# Altium schematic sheet USB.SchDoc
size A4
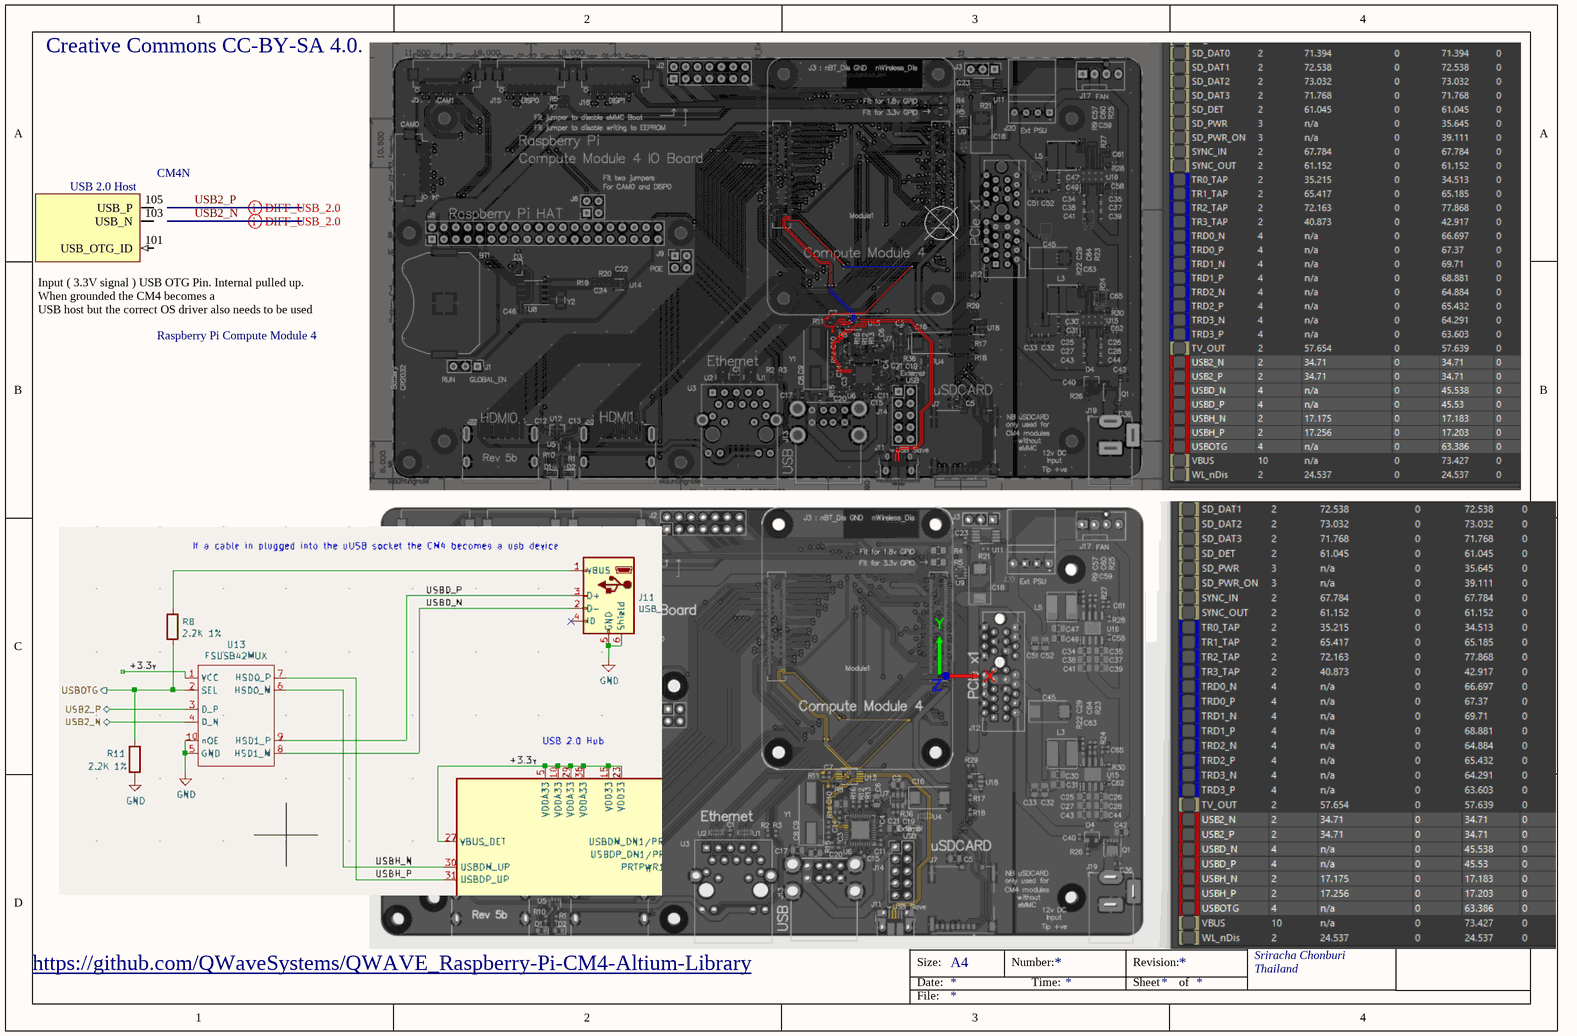
[diagram p0: USB.SchDoc]

## Parts
CM4  Raspberry Pi Compute Module 4  [CM4-F40C-100DS-0.4v_1.5mm_0mm]  (part N of 21)  (no BOM)

## Nets

Not connected (* = marked no-connect by the designer): CM4 101(USB_OTG_ID) 103(USB_N) 105(USB_P)

## Layout directives
differential pair; differential pair class DIFF_90Ohm_USB2.0; differential pair class DIFF_USB2.0; net class USB2.0_480Mbps: USB2_N, USB2_P

## Notes on the sheet
- Creative Commons CC-BY-SA 4.0.
- https://github.com/QWaveSystems/QWAVE_Raspberry-Pi-CM4-Altium-Library
- Title
- Size:
- Date:
- A4
- Number:
- Time:
- Revision:
- Sheet
- of
- Q-Wave Systems Co.,Ltd
- 65/2 Moo 1 Beung
- Sriracha Chonburi
- Thailand
- File:
- (in symbol CM4, part N) USB 2.0 Host; Input ( 3.3V signal ) USB OTG Pin. Internal pulled up. When grounded the CM4 becomes a / USB host but the correct OS driver also needs to be used

## Library data of the parts
CM4 = CM4: Raspberry Pi Compute Module 4 by Amornthep Phunsin